# Altium schematic sheet pca10028_power_supply.SchDoc: PCA10028 - Power Supply
size A4; Revision: 1.2.0; SheetNumber: 5; SheetTotal: 5; DrawnBy: RUBR; ProjectNumber: 4403; PCBRevision: 0202RUBR; DocumentSize: A4; PCAName: PCA10028; PCBNumber: 400092; ProjectName: Cost optimized nRF51-EK
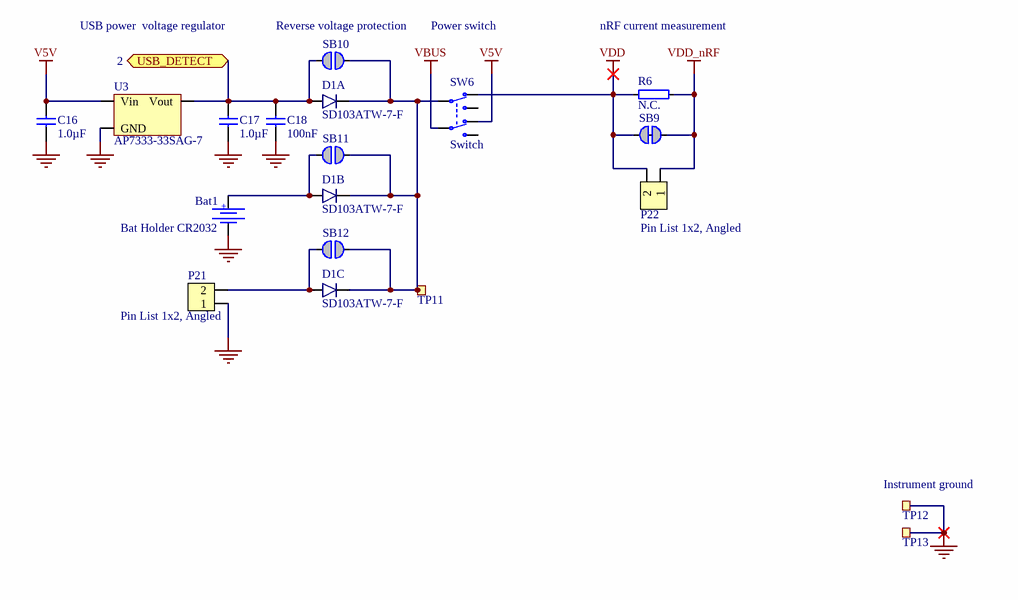
[diagram p0: pca10028_power_supply.SchDoc]

## Parts
Bat1  Bat Holder CR2032  [CR2032_HOLDER_SMD]
C16  1.0µF  [CAPC1608X06L]
C17  1.0µF  [CAPC1608X06L]
C18  100nF  [CAPC1005X04L]
D1  SD103ATW-7-F  [SOT-363]  (parts A,B,C of 3)
P21  Pin List 1x2, Angled  [LIST_ANG_1x2-SMD-2.54MM]
P22  Pin List 1x2, Angled  [LIST_ANG_1x2-SMD-2.54MM]
R6  N.C.  [RESC1005X04L]
SB9  Solderbridge  [Solderbridge_Shorted]  (value not drawn)  (net tie, no BOM)
SB10  Solderbridge  [Solderbridge]  (value not drawn)  (no BOM)
SB11  Solderbridge  [Solderbridge]  (value not drawn)  (no BOM)
SB12  Solderbridge  [Solderbridge]  (value not drawn)  (no BOM)
SW6  Switch  [JS202011SCQN]
TP11  Ø1.0mm,SMD  [TP_SMD_Ø1.0mm]  (value not drawn)  (no BOM)
TP12  TP  [TESTPAD-TH]  (value not drawn)  (no BOM)
TP13  TP  [TESTPAD-TH]  (value not drawn)  (no BOM)
U3  AP7333-33SAG-7  [SOT-23A]

## Ports
USB_DETECT (bidir, see 2)

## Nets
GND: Bat1.2 C16.1 C17.1 C18.1 P21.1 TP12.1 TP13.1 U3.3(GND)
V5V: C16.2 SW6.6(N.C-2) U3.1(Vin)
VBUS: SW6.5(COM-2)
VDD: P22.2 R6.1 SB9.2 SW6.3(N.C-1)
VDD_nRF: P22.1 R6.2 SB9.1
USB_DETECT: C17.2 C18.2 D1.6(A1) SB10.2 U3.2(Vout) ; port USB_DETECT
NetBat1_1: Bat1.1 D1.5(A2) SB11.2
NetD1_1: D1.1(C1) D1.2(C2) D1.3(C3) SB10.1 SB11.1 SB12.1 SW6.2(COM-1) TP11.1
NetD1_4: D1.4(A3) P21.2 SB12.2

Not connected (* = marked no-connect by the designer): SW6 1(N.O-1) 4(N.O-2)

## Notes on the sheet
- USB power  voltage regulator
- (near SB10) Reverse voltage protection
- Power switch
- nRF current measurement
- (near TP12) Instrument ground
- Title
- Size
- Date:
- Project Number
- Sheet         of
- Revision
- File:
- Drawn By:
- (in symbol Bat Holder CR2032 SMD) +

## Library data of the parts
Bat1 = Bat Holder CR2032 SMD: Manufacturer: Keystone; Manufacturer Part Number: 3002; 2nd source part number: 69-525-27; Artikkelnr Noca: 34019038; Artikkelnr Simpro: N.A.; Part Number: Bat Holder CR2032 SMD; Datasheet: http://www.farnell.com/datasheets/45480.pdf; LatestRevisionDate: 2011-05-11; Pin Count: 3; Publisher: Nordic Semiconductor; Published: 2009-12-12; Value: Bat Holder CR2032; Note: Bat Holder CR2032; Supplier: Farnell; Supplier part number: 165-0693; 2nd source Supplier: Elfa; Footprint Doc: CR2032_HOLDER_SMD
C16 C17 = C0603-1µ0: Capacitor, X7R, ±10%; Note: 16V; Artikkelnr Noca: 20039335; Artikkelnr Simpro: N.A.; Published: 2009-05-08; LatestRevisionDate: 2013-06-05; Publisher: Nordic Semiconductor; Value: 1.0µF; Part Number: C0603-1µ0; Manufacturer: *; Manufacturer Part Number: *; Datasheet: *; Pin Count: 2; Supplier: *; Supplier part number: *; 2nd source Supplier: *; 2nd source part number: *; Footprint Doc: 0603
C18 = C0402-100n: Capacitor, X7R, ±10%; Note: 16V; Artikkelnr Noca: 20039200; Artikkelnr Simpro: N.A.; Published: 2009-05-08; LatestRevisionDate: 2009-11-23; Publisher: Nordic Semiconductor; Value: 100nF; Part Number: C0402-100n; Manufacturer: *; Manufacturer Part Number: *; Datasheet: *; Pin Count: 2; Supplier: *; Supplier part number: *; 2nd source Supplier: *; 2nd source part number: *; Footprint Doc: 0402
D1 = SD103ATW-7-F: Surface Mount Schottky Barrier Diode Array; Manufacturer: Diodes Incorporated; 2nd source part number: 177-3507; Artikkelnr Noca: 10029109; Artikkelnr Simpro: N.A.; Part Number: SD103ATW-7-F; Manufacturer Part Number: SD103ATW-7-F; Datasheet: http://www.diodes.com/datasheets/ds30374.pdf; LatestRevisionDate: 2012-06-15; Publisher: Nordic Semiconductor; Published: 2012-06-15; Value: SD103ATW-7-F; Note: *; Supplier: Digi-Key; Supplier part number: SD103ATW-FDITR-ND; 2nd source Supplier: Farnell; Footprint Doc: SOT-363
P21 P22 = Pin List Ang 1x2 SMD, 2.54mm: Pin List 1x2, 2.54mm (100mil), Right Angled, SMD; 2nd source part number: S1113E-02-ND; Artikkelnr Noca: 55019265; Artikkelnr Simpro: N.A.; Part Number: Pin List Ang 1x2 SMD, 2.54mm; Manufacturer: *; Manufacturer Part Number: *; Datasheet: *; LatestRevisionDate: 2014-09-17; Pin Count: 2; Publisher: Nordic Semiconductor; Published: 2014-04-30; Value: Pin List 1x2, Angled; Note: *; Supplier: Samtec; Supplier part number: TSM-102-01-L-SH-A; 2nd source Supplier: Digi-Key; Footprint Doc: LIST_ANG_1x2-SMD-2.54MM
R6 = R0402-N.C.: Not mounted; Note: Chip Res; Artikkelnr Noca: N.A.; Part Number: R0402-N.C.; Manufacturer: *; Manufacturer Part Number: *; Datasheet: *; LatestRevisionDate: 2009-05-08; Pin Count: 2; Publisher: Nordic Semiconductor; Published: 2009-05-08; Value: N.C.; Supplier: *; Supplier part number: *; 2nd source Supplier: *; 2nd source part number: *; Footprint Doc: 0402; Artikkelnr Simpro: N.A.
SB9 = Solderbridge Shorted: Shorted Solderbridge; Artikkelnr Noca: N.A.; Part Number: Solderbridge Shorted; Manufacturer: *; Manufacturer Part Number: *; Datasheet: *; LatestRevisionDate: 2012-08-07; Pin Count: 2; Publisher: Nordic Semiconductor; Published: 2012-08-07; Value: Solderbridge; Note: *; Supplier: *; Supplier part number: *; 2nd source Supplier: *; 2nd source part number: *; Footprint Doc: Solderbridge_Shorted; Artikkelnr Simpro: N.A.
SB10-SB12 = Solderbridge: Artikkelnr Noca: N.A.; Part Number: Solderbridge; Manufacturer: *; Manufacturer Part Number: *; Datasheet: *; LatestRevisionDate: 2009-12-14; Pin Count: 2; Publisher: Nordic Semiconductor; Published: 2009-12-14; Value: Solderbridge; Note: *; Supplier: *; Supplier part number: *; 2nd source Supplier: *; 2nd source part number: *; Footprint Doc: Solderbridge; Artikkelnr Simpro: N.A.
SW6 = JS202011SCQN: SMD slide Switch (ON-ON); Manufacturer: C&K Components; 2nd source part number: 232-0019; Artikkelnr Noca: 50019088; Artikkelnr Simpro: N.A.; Part Number: JS202011SCQN; Manufacturer Part Number: JS202011SCQN; Datasheet: http://www.ck-components.com/14398/js_14july11.pdf/; LatestRevisionDate: 2014-09-17; Pin Count: 6; Publisher: Nordic Semiconductor; Published: 2014-06-24; Value: Switch; Note: *; Supplier: Digi-Key; Supplier part number: 401-2002-1-ND; 2nd source Supplier: Farnell; Footprint Doc: JS202011SCQN
TP11 = TP_SMD_Ø1.0MM: 1.0mm circular SMD testpad; Manufacturer: Nordic Semiconductor; Artikkelnr Noca: N.A.; Part Number: TP_SMD_Ø1.0MM; Manufacturer Part Number: *; Datasheet: *; LatestRevisionDate: 2013-06-11; Pin Count: 1; Publisher: Nordic Semiconductor; Published: 2013-06-11; Value: Ø1.0mm,SMD; Note: *; Supplier: *; Supplier part number: *; 2nd source Supplier: *; 2nd source part number: *; Footprint Doc: TP_SMD_Ø1.0mm; Artikkelnr Simpro: N.A.
TP12 TP13 = Testpoint TH: Testpoint, through hole; Artikkelnr Noca: N.A.; Part Number: Testpoint TH; Manufacturer: *; Manufacturer Part Number: *; Datasheet: *; Footprint Doc: TESTPAD-TH; LatestRevisionDate: 2009-12-12; Pin Count: 1; Publisher: Nordic Semiconductor; Published: 2009-12-12; Value: TP; Note: *; Supplier: *; Supplier part number: *; 2nd source Supplier: *; 2nd source part number: *; Artikkelnr Simpro: N.A.
U3 = AP7333-33SAG-7: 300mA, Low Quiescent Current, Fast Transient Low Dropout Linear Regulator; Manufacturer: Diodes Incorporated; Artikkelnr Noca: 17039216; Artikkelnr Simpro: N.A.; Part Number: AP7333-33SAG-7; Manufacturer Part Number: AP7333-33SAG-7; Datasheet: http://www.diodes.com/datasheets/AP7333.pdf; LatestRevisionDate: 2012-06-15; Pin Count: 3; Publisher: Nordic Semiconductor; Published: 2012-06-15; Value: AP7333-33SAG-7; Note: *; Supplier: Digi-Key; Supplier part number: AP7333-33SAG-7DICT-ND; 2nd source Supplier: *; 2nd source part number: *; Footprint Doc: SOT-23-3